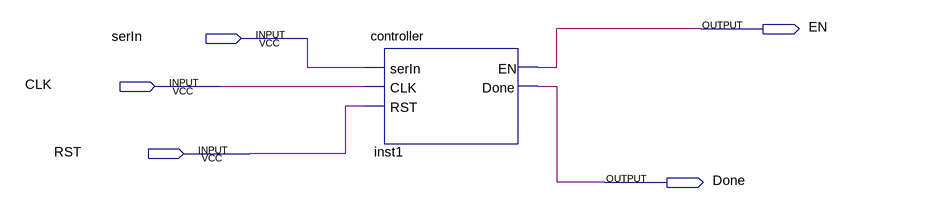
[diagram p0: schematic sheet]
// Quartus schematic test.bdf as structural Verilog: 1 symbols, 5 pins
module test (
  input  serIn,
  input  CLK,
  input  RST,
  output EN,
  output Done
);

  controller inst1 (.serIn(serIn), .CLK(CLK), .RST(RST), .EN(EN), .Done(Done));
endmodule
